# EAGLE design Loco-Single (EAGLE 9.7.0)

## Sheet 1 of 2
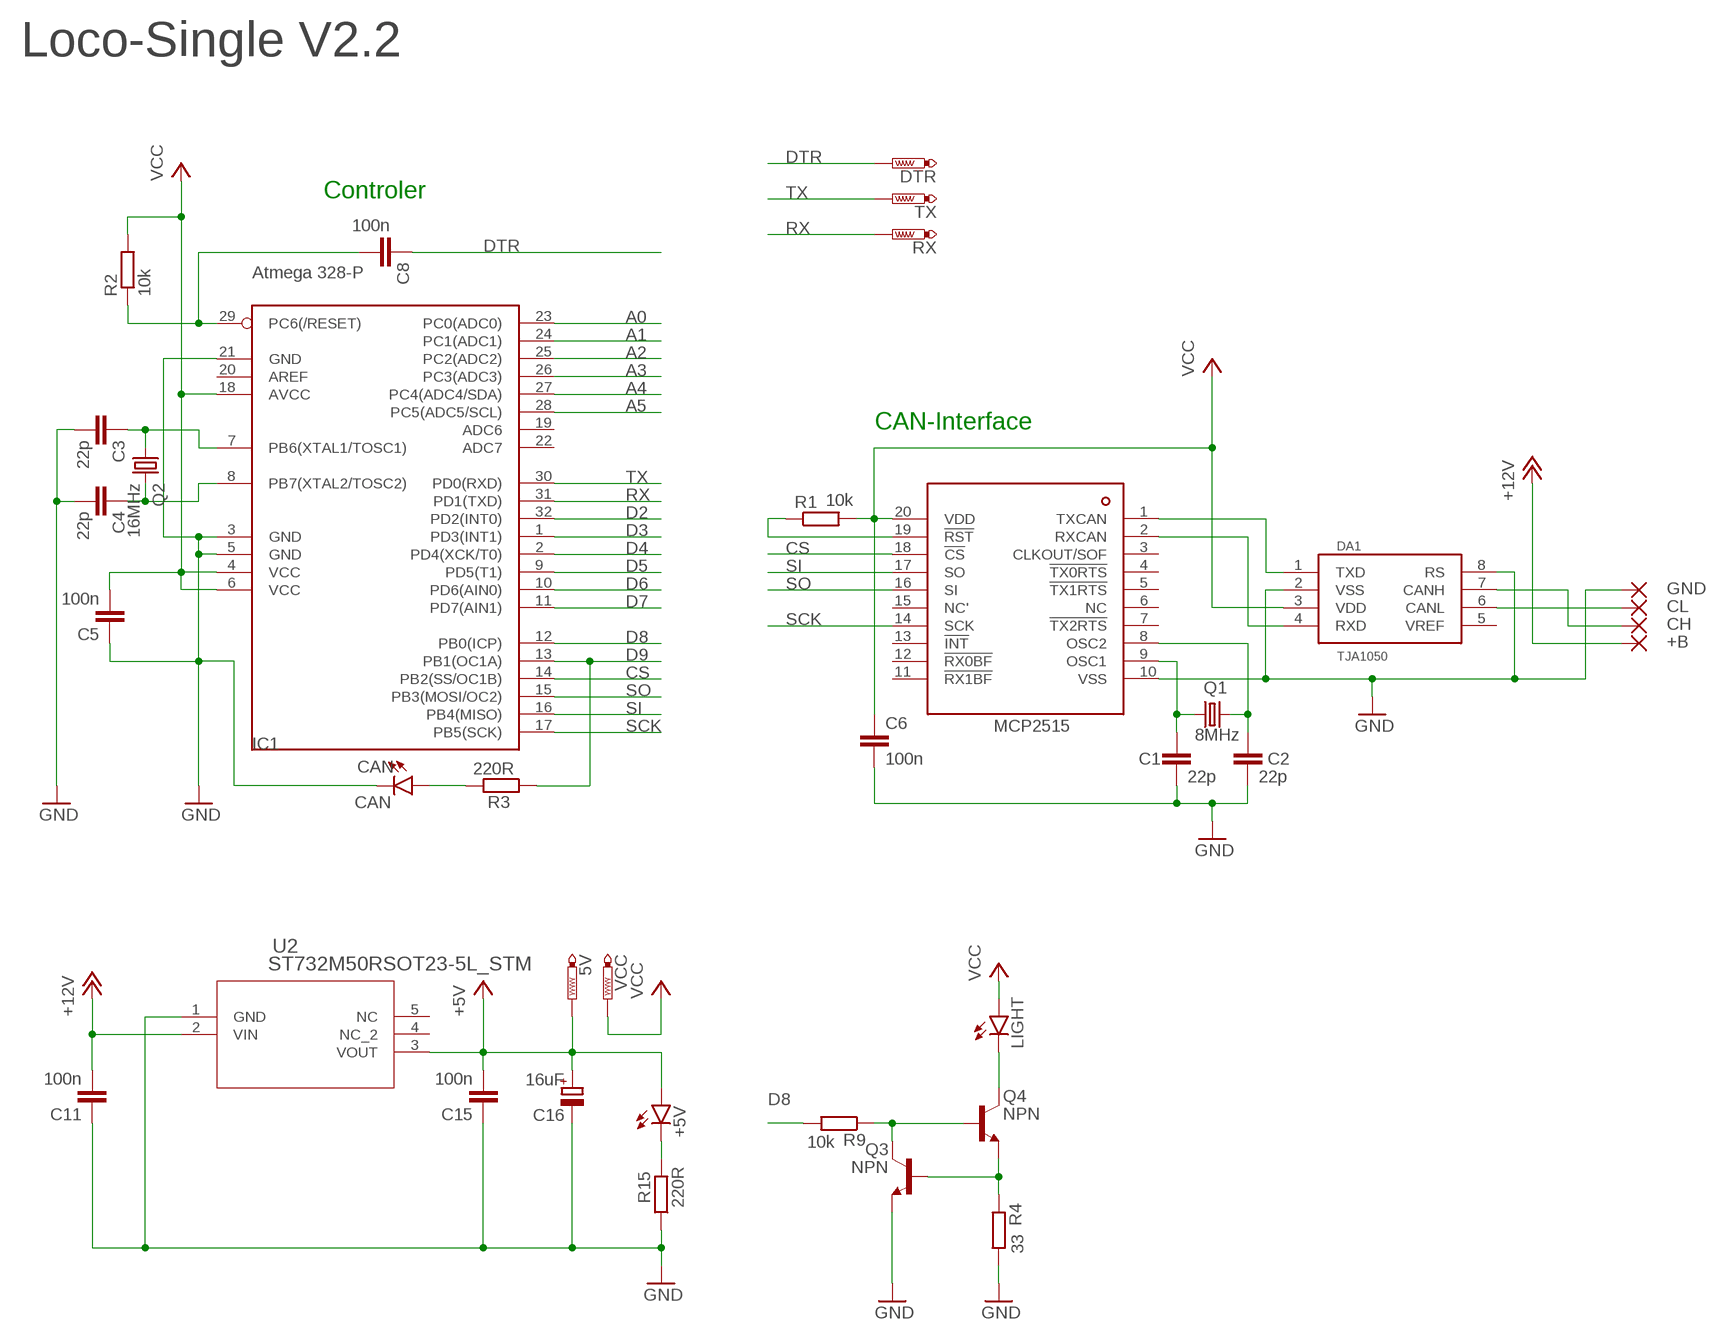
[diagram p0: schematic, sheet 1]

### Parts
5V  PTR1B1,27  [B1,27]
+5V  LEDCHIP-LED0603  [CHIP-LED0603]
+B  1,6/0,8  [1,6/0,8]
C1  22p  C-EUC0402K  [C0402K]
C2  22p  C-EUC0402K  [C0402K]
C3  22p  C-EUC0402K  [C0402K]
C4  22p  C-EUC0402K  [C0402K]
C5  100n  C-EUC0402K  [C0402K]
C6  100n  C-EUC0402K  [C0402K]
C8  100n  C-EUC0402K  [C0402K]
C11  100n  C-EUC0402K  [C0402K]
C15  100n  C-EUC0402K  [C0402K]
C16  16uF  CPOL-EUA/3216-18W  [A/3216-18W]
CAN  CAN  LED_CHIP_BLUE-1608  [LEDC1608X39N_B]
CH  1,6/0,8  [1,6/0,8]
CL  1,6/0,8  [1,6/0,8]
DA1  TJA1050  [SO08]
DTR  PTR1B1,27  [B1,27]
GND  1,6/0,8  [1,6/0,8]
IC1  Atmega 328-P  MEGA8-AI  [TQFP32-08]
IC2  MCP2515  [TSSOP20]
LIGHT  LEDCHIP-LED0603  [CHIP-LED0603]
Q1  8MHz  KX-9B  [5.0X3.2_2]
Q2  16MHz  KX-9B  [5.0X3.2_2]
Q3  NPN  NPN_SOT23-BEC  [SOT95P237X112-3N]
Q4  NPN  NPN_SOT23-BEC  [SOT95P237X112-3N]
R1  10k  R-EU_R0402  [R0402]
R2  10k  R-EU_R0402  [R0402]
R3  220R  R-EU_R0402  [R0402]
R4  33  R-EU_R0402  [R0402]
R9  10k  R-EU_R0402  [R0402]
R15  220R  R-EU_R0402  [R0402]
RX  PTR1B1,27  [B1,27]
TX  PTR1B1,27  [B1,27]
U2  ST732M50RSOT23-5L_STM  [SOT23-5L_STM]
VCC  PTR1B1,27  [B1,27]

### Nets
+5V: 5V.TP +5V.A C15.2 C16.+ U2.3(VOUT)
+12V: +B.1(P) C11.2 U2.2(VIN)
A0: IC1.23(PC0(ADC0))
A1: IC1.24(PC1(ADC1))
A2: IC1.25(PC2(ADC2))
A3: IC1.26(PC3(ADC3))
A4: IC1.27(PC4(ADC4/SDA))
A5: IC1.28(PC5(ADC5/SCL))
CAN-H: CH.1(P) DA1.7(CANH)
CAN-L: CL.1(P) DA1.6(CANL)
CAN-OCC1: C1.1 IC2.9(OSC1) Q1.1
CAN-OCC2: C2.1 IC2.8(OSC2) Q1.2
CS: IC1.14(PB2(SS/OC1B)) IC2.18(!CS)
D2: IC1.32(PD2(INT0))
D3: IC1.1(PD3(INT1))
D4: IC1.2(PD4(XCK/T0))
D5: IC1.9(PD5(T1))
D6: IC1.10(PD6(AIN0))
D7: IC1.11(PD7(AIN1))
D8: IC1.12(PB0(ICP)) R9.2
D9: IC1.13(PB1(OC1A)) R3.1
DTR: C8.1 DTR.TP
GND: C1.2 C2.2 C3.2 C4.2 C5.1 C6.2 C11.1 C15.1 C16.- CAN.1(C) DA1.2(VSS) DA1.8(RS) GND.1(P) IC1.3(GND) IC1.5(GND) IC1.21(GND) IC2.10(VSS) Q3.2(E) R4.2 R15.1 U2.1(GND)
N$3: CAN.2(A) R3.2
N$4: Q3.1(B) Q4.2(E) R4.1
N$5: Q3.3(C) Q4.1(B) R9.1
N$6: IC2.19(!RST) R1.1
N$7: LIGHT.C Q4.3(C)
N$10: C3.1 IC1.7(PB6(XTAL1/TOSC1)) Q2.1
N$11: C4.1 IC1.8(PB7(XTAL2/TOSC2)) Q2.2
N$12: +5V.C R15.2
N$15: C8.2 IC1.29(PC6(/RESET)) R2.1
RX: IC1.31(PD1(TXD)) RX.TP
RXCAN: DA1.4(RXD) IC2.2(RXCAN)
SCK: IC1.17(PB5(SCK)) IC2.14(SCK)
SI: IC1.16(PB4(MISO)) IC2.17(SO)
SO: IC1.15(PB3(MOSI/OC2)) IC2.16(SI)
TX: IC1.30(PD0(RXD)) TX.TP
TXCAN: DA1.1(TXD) IC2.1(TXCAN)
VCC: C5.2 C6.1 DA1.3(VDD) IC1.4(VCC) IC1.6(VCC) IC1.18(AVCC) IC2.20(VDD) LIGHT.A R1.2 R2.2 VCC.TP
Unconnected: DA1.5(VREF) IC1.19(ADC6) IC1.20(AREF) IC1.22(ADC7) IC2.3(CLKOUT/SOF) IC2.4(!TX0RTS) IC2.5(!TX1RTS) IC2.6(NC) IC2.7(!TX2RTS) IC2.11(!RX1BF) IC2.12(!RX0BF) IC2.13(!INT) IC2.15(NC') U2.4(NC_2) U2.5(NC)

### Notes on the sheet
- Loco-Single V2.2
- Controler
- CAN-Interface

## Sheet 2 of 2

## Library data of the parts
5V DTR RX TX VCC = testpad:PTR1: TEST PIN
+5V LIGHT = led:LED: LED OSRAM: - CHIPLED LG R971, LG N971, LY N971, LG Q971, LY Q971, LO R971, LY R971 LH N974, LH R974 LS Q976, LO Q976, LY Q976 LO Q996 - Hyper CHIPLED LW Q18S LB Q993, LB Q99A, LB R99A - SideLED LS A670, LO A670, LY A670, LG A670, LP A670 LB A673, LV A673, LT A673, LW A673 LH A674 LY A675 LS A676, LA A676, LO A676, LY A676, LW A676 LS A679, LY A679, LG A679 - Hyper Micro SIDELED® LS Y876, LA Y876, LO Y876, LY Y876 LT Y87S - SmartLED LW L88C, LW L88S LB L89C, LB L89S, LG L890 LS L89K, LO L89K, LY L89K LS L896, LA L896, LO L896, LY L896 - TOPLED LS T670, LO T670, LY T670, LG T670, LP T670 LSG T670, LSP T670, LSY T670, LOP T670, LYG T670 LG T671, LOG T671, LSG T671 LB T673, LV T673, LT T673, LW T673 LH T674 LS T676, LA T676, LO T676, LY T676, LB T676, LH T676, LSB T676, LW T676 LB T67C, LV T67C, LT T67C, LS T67K, LO T67K, LY T67K, LW E67C LS E67B, LA E67B, LO E67B, LY E67B, LB E67C, LV E67C, LT E67C LW T67C LS T679, LY T679, LG T679 LS T770, LO T770, LY T770, LG T770, LP T770 LB T773, LV T773, LT T773, LW T773 LH T774 LS E675, LA E675, LY E675, LS T675 LS T776, LA T776, LO T776, LY T776, LB T776 LHGB T686 LT T68C, LB T68C - Hyper Mini TOPLED® LB M676 - Mini TOPLED Santana® LG M470 LS M47K, LO M47K, LY M47K Source: http://www.osram.convergy.de LUXEON: - LUMILED® LXK2-PW12-R00, LXK2-PW12-S00, LXK2-PW14-U00, LXK2-PW14-V00 LXK2-PM12-R00, LXK2-PM12-S00, LXK2-PM14-U00 LXK2-PE12-Q00, LXK2-PE12-R00, LXK2-PE12-S00, LXK2-PE14-T00, LXK2-PE14-U00 LXK2-PB12-K00, LXK2-PB12-L00, LXK2-PB12-M00, LXK2-PB14-N00, LXK2-PB14-P00, LXK2-PB14-Q00 LXK2-PR12-L00, LXK2-PR12-M00, LXK2-PR14-Q00, LXK2-PR14-R00 LXK2-PD12-Q00, LXK2-PD12-R00, LXK2-PD12-S00 LXK2-PH12-R00, LXK2-PH12-S00 LXK2-PL12-P00, LXK2-PL12-Q00, LXK2-PL12-R00 Source: www.luxeon.com KINGBRIGHT: KA-3528ASYC Source: www.kingbright.com
+B CH CL GND = wirepad:1,6/0,8: THROUGH-HOLE PAD
C1-C6 C8 C11 C15 = rcl:C-EU: CAPACITOR, European symbol; SPICEPREFIX: C
C16 = rcl:CPOL-EU: POLARIZED CAPACITOR, European symbol; SPICEPREFIX: C
CAN = Opto-Electronic:LED_CHIP: LED - Generic; CATEGORY: Opto-Electronic; COLOR: Blue; SUB-CATEGORY: LED; VALUE: LED_BLUE
DA1 = TJA1050:TJA1050: High speed CAN transceiver Input levels compatible with 3.3 V and 5 V devices 5V supply
IC1 = atmel:MEGA8: MICROCONTROLLER 8 Kbytes FLASH, 1 kbytes SRAM, 512 bytes EEPROM, USART, 6-channel 10 bit ADC, 2-channel 8 bit ADC Pin compatible with Atmega48, ATMega88, ATMega168 Source: avr.lbr; MPN: ATMEGA8-16AU; OC_FARNELL: 9171371; OC_NEWARK: 73M8863
IC2 = mcp2514:MCP2515: Microchip Technology’s MCP2515 is a stand-alone Controller Area Network (CAN) controller that implements the CAN specification, version 2.0B. It is capable of transmitting and receiving both standard and extended data and remote frames. The MCP2515 has two acceptance masks and six acceptance filters that are used to filter out unwanted messages, thereby reducing the host MCUs overhead. The MCP2515 interfaces with microcontrollers (MCUs) via an industry standard Serial Peripheral Interface (SPI).
Q1 Q2 = crystal-geyer_V1_0:KX: Quartz Crystals (MHz) SMD: KX - Serie Model Size l/w/h [mm] Frequency Range Frequency Stability Temp. Range [°C] Load Capacitance AECQ 200 availabel Datasheet KX-4 KX-5 KX-6 KX-7 KX-9A KX-9B KX-12A KX-12B KX-13 KX-20 KX-K KX-KS 1.6/1.2/0.3 2.0/1.6/0.45 2.5/2.0/0.55 3.2/2.5/0.8 5.0/3.2/1.0 5.0/3.2/1.1 6.0/3.5/1.1 6.0/3.5/1.0 7.0/5.0 /1.3 11.6/5.5/1.6 12.3/4.5/4.2 12.3/4.5/3.2 24.0 ~ 80.0 MHz 16.0 ~ 80.0 MHz 12.0 ~ 80.0 MHz 8.0 ~ 60.0 MHz 7,68 ~ 300,0 MHz 8,0 ~ 50,0 MHz 8,0 ~ 150,0 MHz 8,0 ~ 50,0 MHz 6,0 ~ 160,0 MHz 3,579 ~ 25,0 MHz 3,579 ~ 70,0 MHz 3,579 ~ 70,0 MHz ±10 … ±50ppm ±10 … ±50ppm ±10 … ±50ppm ±10 … ±50ppm ±10 … ±50ppm ±10 … ±50ppm ±10 … ±50ppm ±10 … ±50ppm ±10 … ±50ppm ±50ppm ±10 … ±50ppm ±10 … ±50ppm (*) -40°C …+85°C (*) -40°C …+125°C (*) -40°C …+125°C (*) -40°C …+125°C (*) -40°C …+105°C (*) -40°C …+105°C (*) -40°C …+125°C (*) -40°C …+105°C (*) -40°C …+105°C (*) -40°C …+105°C (*) -40°C …+85°C (*) -40°C …+85°C 8, 8…16 8, 8…16 10, 8…16 12, 7…20 16, 10…20 16, 10…20 16, 10…20 16, 12…20 16, 12…20 16, 12…20 16, 12…30 16, 12…30 - yes yes yes - - - - - - - - KX-4.pdf <http://www.geyer-electronic.de/uploads/tx_userartikelfrequenz/GEYER-KX-4.pdf> KX-5.pdf <http://www.geyer-electronic.de/uploads/tx_userartikelfrequenz/GEYER-KX-5.pdf> KX-6.pdf <http://www.geyer-electronic.de/uploads/tx_userartikelfrequenz/GEYER-KX-6.pdf> KX-7.pdf <http://www.geyer-electronic.de/uploads/tx_userartikelfrequenz/GEYER-KX-7.pdf> KX-9A.pdf <http://www.geyer-electronic.de/uploads/tx_userartikelfrequenz/GEYER-KX-9A.pdf> KX-9B.pdf <http://www.geyer-electronic.de/uploads/tx_userartikelfrequenz/GEYER-KX-9B.pdf> KX-12A.pdf <http://www.geyer-electronic.de/uploads/tx_userartikelfrequenz/GEYER-KX-12A.pdf> KX-12B.pdf <http://www.geyer-electronic.de/uploads/tx_userartikelfrequenz/GEYER-KX-12B.pdf> KX-13.pdf <http://www.geyer-electronic.de/uploads/tx_userartikelfrequenz/GEYER-KX-13.pdf> KX-20.pdf <http://www.geyer-electronic.de/uploads/tx_userartikelfrequenz/GEYER-KX-20.pdf> KX-K.pdf <http://www.geyer-electronic.de/uploads/tx_userartikelfrequenz/GEYER-KX-K.pdf> KX-KS.pdf <http://www.geyer-electronic.de/uploads/tx_userartikelfrequenz/GEYER-KX-KS.pdf> <http://www.geyer-electronic.de/fileadmin/template/img/logo-geyer-electronic.png> Details see: http://www.geyer-electronic.de/Frequenz-Produkte.9.0.html Created 2016-06-07, Hans Locher 2016 (C) Geyer Quartz Technology KX4,KX5,KX6,KX7,KX9A,KX9B,KX12A,KX12B,KX13,KX20,KXK,KXKS;1612;2016;2520;3225;5032;6035;7050;11655;12345;1,6x1,2;2,0x1,6;2,5x2,0;3,2x2,5;5,0x3,2;6,0x3,5;7,0x5,0;11,6x5,5;12,3x4,5;12,3x4,5;1.6x1.2;2.0x1.6;2.5x2.0;3.2x2.5;5.0x3.2;6.0x3.5;7.0x5.0;11.6x5.5;12.3x4.5;12.3x4.5;
Q3 Q4 = Transistor:NPN: NPN - Generic; CATEGORY: Transistor; SUB-CATEGORY: BJT; TYPE: NPN
R1-R4 R9 R15 = rcl:R-EU_: RESISTOR, European symbol; SPICEPREFIX: R
U2 = ST732:ST732M50R; COPYRIGHT: Copyright (C) 2023 Ultra Librarian. All rights reserved.; MANUFACTURER_PART_NUMBER: ST732M50R; MFR_NAME: STMicroelectronics

## Board
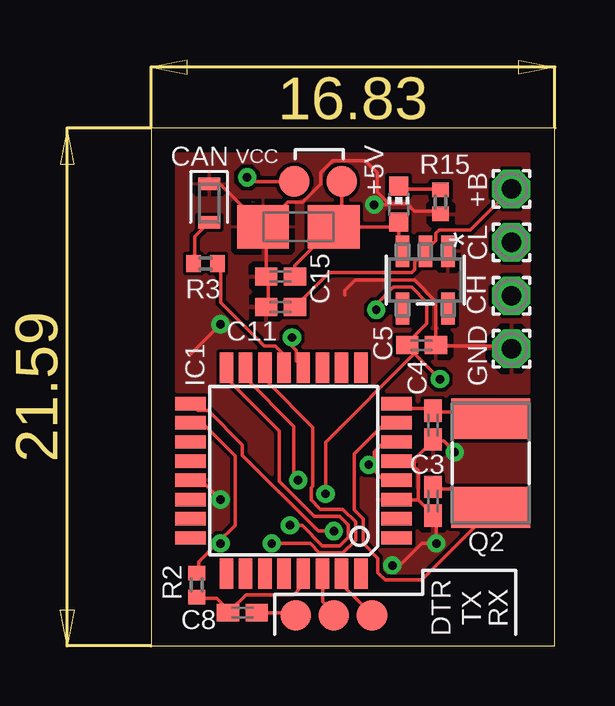
[diagram p1: board, top side]
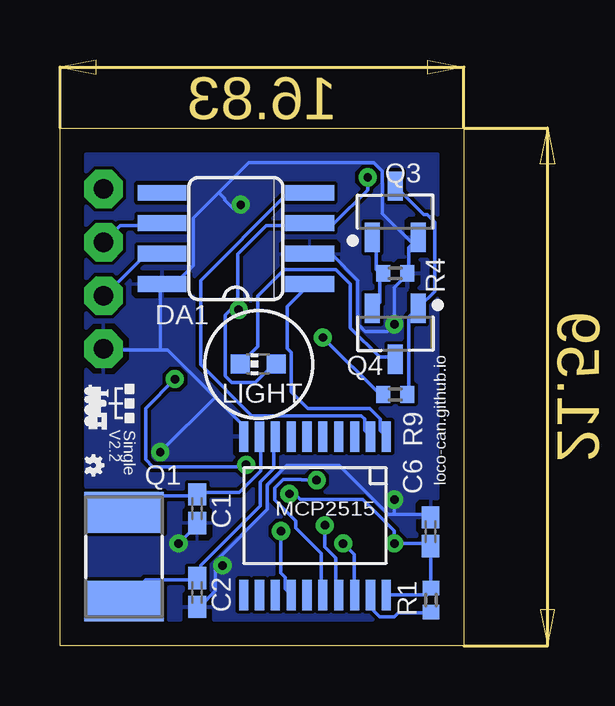
[diagram p2: board, bottom side, seen from below]

Size 16.83 x 21.59 mm. Coordinates in mm from the lower left corner, seen from the top.
Outline: 16.83,21.59 0,21.59 0,0 16.83,0 16.83,21.59
Copper layers (1*16): Top / Bottom
Stack-up Default Layer Stack: Top User Defined 0.035mm / Dielectric-1 User Defined 1.5mm / Bottom User Defined 0.035mm
Design rules "default": minimum track width 6mil, minimum drill 0.35mm, track to track 6mil, track to pad 6mil, pad to pad 6mil, via to via 6mil, smd to smd 6mil, copper to edge 40mil, drill to drill 6mil, minimum pad ring 10mil, minimum via ring 8mil, stop-mask expansion 4mil, vias tented up to drill 0mil, thermal gap 10mil

### Footprints (pad centres in the part's own frame; a part is rotated, then mirrored left to right if it is on the bottom)
B1,27 = smd 1.27 x 1.27: TP 0,0
CHIP-LED0603 = smd 0.8 x 0.8: A 0,-0.75; C 0,0.75
1,6/0,8 = drill 0.813 pad 1.6 octagon: 1 0,0
C0402K = smd 0.925 x 0.74: 1 -0.6,0; 2 0.6,0
A/3216-18W = smd 2.15 x 1.8: + 1.475,0; - -1.475,0
LEDC1608X39N_B = smd 0.512 x 0.912: 1 -0.8,0; 2 0.8,0
SO08 = smd 0.66 x 2.032: 1 -1.905,-3.073; 2 -0.635,-3.073; 3 0.635,-3.073; 4 1.905,-3.073; 5 1.905,3.073; 6 0.635,3.073; 7 -0.635,3.073; 8 -1.905,3.073
TQFP32-08 = smd 1.27 x 0.559: 1 -4.293,2.8; 2 -4.293,2; 3 -4.293,1.2; 4 -4.293,0.4; 5 -4.293,-0.4; 6 -4.293,-1.2; 7 -4.293,-2; 8 -4.293,-2.8; 17 4.293,-2.8; 18 4.293,-2; 19 4.293,-1.2; 20 4.293,-0.4; 21 4.293,0.4; 22 4.293,1.2; 23 4.293,2; 24 4.293,2.8 | smd 0.559 x 1.27: 9 -2.8,-4.293; 10 -2,-4.293; 11 -1.2,-4.293; 12 -0.4,-4.293; 13 0.4,-4.293; 14 1.2,-4.293; 15 2,-4.293; 16 2.8,-4.293; 25 2.8,4.293; 26 2,4.293; 27 1.2,4.293; 28 0.4,4.293; 29 -0.4,4.293; 30 -1.2,4.293; 31 -2,4.293; 32 -2.8,4.293
TSSOP20 = smd 1.27 x 0.381: 1 -3.302,2.642; 2 -3.302,1.981; 3 -3.302,1.321; 4 -3.302,0.66; 5 -3.302,0; 6 -3.302,-0.66; 7 -3.302,-1.321; 8 -3.302,-1.981; 9 -3.302,-2.642; 10 -3.302,-3.302; 11 3.302,-3.302; 12 3.302,-2.642; 13 3.302,-1.981; 14 3.302,-1.321; 15 3.302,-0.66; 16 3.302,0; 17 3.302,0.66; 18 3.302,1.321; 19 3.302,1.981; 20 3.302,2.642
5.0X3.2_2 = smd 1.7 x 3.3: 1 -1.85,0; 2 1.85,0
SOT95P237X112-3N = smd 1.224 x 0.625: 1 -1.064,0.95; 2 -1.064,-0.95; 3 1.064,0
R0402 = smd 0.6 x 0.7: 1 -0.5,0; 2 0.5,0
SOT23-5L_STM = smd 1.321 x 0.559: 1 -1.194,0.95; 2 -1.194,0; 3 -1.194,-0.95; 4 1.194,-0.95; 5 1.194,0.95

### Placement (x,y rotation side)
5V  7.94,19.37 0 top
+5V  10.32,18.41 0 top
+B  15.01,19.05 90 top
C1  11.11,5.71 270 bottom
C2  11.11,2.22 270 bottom
C3  11.75,6.03 270 top
C4  11.75,9.21 270 top
C5  11.27,12.54 180 top
C6  1.39,4.76 90 bottom
C8  3.81,1.39 180 top
C11  5.4,14.13 0 top
C15  5.4,15.4 0 top
C16  6.14,17.47 0 top
CAN  2.42,18.46 270 top
CH  15.01,14.61 90 top
CL  15.01,16.83 90 top
DA1  9.5,16.99 90 bottom
DTR  6.03,1.27 180 top
GND  15.01,12.38 90 top
IC1  5.94,7.3 180 top
IC2  5.87,5.43 270 bottom
LIGHT  8.57,11.75 90 bottom
Q1  14.16,3.72 270 bottom
Q2  14.16,7.62 90 top
Q3  2.86,18.1 90 bottom
Q4  2.86,13.02 270 bottom
R1  1.37,1.91 90 bottom
R2  1.91,2.54 90 top
R3  2.27,15.94 180 top
R4  2.86,15.54 0 bottom
R9  2.86,10.48 180 bottom
R15  12.06,18.51 90 top
RX  9.21,1.27 180 top
TX  7.62,1.27 180 top
U2  11.43,15.26 270 top
VCC  5.97,19.37 0 top

### Tracks (layer width: path | path; a pad name or v marks a point on that pad's centre or on a via)
+5V
  Top 0.152: 5V.TP 7.94,17.79 C16.+ | C15.2 6,15.85 C16.+ | C16.+ 10.12,17.47 +5V.A 10.32,16.61 U2.3
+12V
  Top 0.152: +B.1 13.3,17.34 12.01,17.34 11.87,17.21 11.87,16.89 11.46,16.48 U2.2 10.99,16.01 10.99,15.7 10.85,15.56 7.43,15.56 C11.2
CAN-H
  Bottom 0.152: DA1.7 12.65,16.31 13.26,16.31 14.94,14.63 CH.1
CAN-L
  Bottom 0.152: DA1.6 12.65,17.53 14.33,17.53 14.94,16.92 CL.1
CAN-OCC1
  Bottom 0.152: Q1.1 14.02,5.64 13.41,6.25 11.12,6.25 C1.1 10.97,6.4 9.36,6.4 8.46,7.3 8.46,8.68 IC2.9
CAN-OCC2
  Bottom 0.152: Q1.2 14.02,1.98 13.26,2.74 11.12,2.74 C2.1 10.97,2.9 10.97,3.35 8.49,5.84 8.49,6.84 7.92,7.4 7.92,8.66 IC2.8
CS  (via drill 0.35)
  Top 0.152: IC1.14 4.88,11.58 4.88,10.97 6.74,9.11 6.74,6.66 6.67,6.59 6.67,6.08 7.05,5.7 8,5.7 8.53,5.16 8.53,4.41 8,3.87 7.02,3.87 6.62,4.27 v5.03,4.27
  Bottom 0.152: v5.03,4.27 4.57,3.81 4.57,2.13 IC2.18
D8  (via drill 0.35)
  Top 0.152: IC1.12 6.05,11.89 6.05,12.32 5.87,12.5 v5.87,12.86
  Bottom 0.152: v5.87,12.86 3.49,10.48 R9.2
D9
  Top 0.152: R3.1 2.9,15.85 2.9,14.33 4.72,12.5 5.18,12.5 5.49,12.19 5.49,11.73 IC1.13
DTR
  Top 0.152: C8.1 4.42,1.37 5.94,1.37 DTR.TP
GND  (via drill 0.35)
  Top 0.152: 10.97,7.77 11.73,8.53 C4.2 11.89,8.53 12.19,8.53 v12.65,8.08 | 10.97,7.77 10.36,7.77 IC1.5 | 11.12,6.1 10.36,6.1 IC1.3 | 11.12,6.1 11.73,5.49 C3.2 11.89,5.33 v11.89,4.27 11.28,4.27 10.36,3.35 v10.06,3.35 | 10.97,7.77 10.97,7.47 11.12,7.32 11.12,6.1 | v2.9,6.1 2.13,6.86 1.68,6.86 IC1.21 | C11.1 4.88,14.17 4.88,15.37 C15.1 4.8,16.67 4.45,17.55 4.49,17.59 C16.- | 9.91,18.44 10.67,18.44 10.97,18.14 12.04,18.14 R15.1 | 1.68,12.19 v2.9,13.41 | GND.1 14.94,12.5 11.89,12.5 C5.1 11.87,14.37 10.98,15.26 8.51,15.26 8.07,14.82 8.07,14.62 | 9.91,18.44 9.44,18.91 9.44,19.73 8.93,20.23 7.58,20.23 7.07,19.73 7.07,19.25 6.33,18.5 5.7,18.5 C16.- | 9.91,18.44 9.86,18.39 v9.3,18.39 | CAN.1 2.48,19.2 2.93,19.2 C16.-
  Bottom 0.152: v11.89,4.27 11.12,5.03 C1.2 | 2.9,5.49 1.52,5.49 C6.2 | 10.36,3.35 10.36,2.29 10.97,1.68 C2.2 | 10.36,3.35 10.36,3.5 8.18,5.68 8.18,6.71 7.38,7.52 5.19,7.52 3.16,5.49 2.9,5.49 | 2.9,5.49 v2.9,6.1 | 10.36,3.35 v10.06,3.35 | 2.13,16.76 1.98,16.92 Q3.2 2.13,16.76 | 2.13,16.76 2.29,16.61 2.29,15.54 R4.2 2.44,15.39 2.9,14.94 v2.9,13.41 3.2,13.11 4.12,13.11 4.42,13.41 4.42,15.24 5.49,16.31 6.4,16.31 DA1.2 | 10.36,10.36 12.34,12.34 12.65,12.34 | 10.36,10.36 9.3,9.3 9.3,8.84 IC2.10 | 12.65,12.34 14.94,12.34 GND.1 | 12.65,12.34 12.65,14.94 DA1.8 12.5,15.09 12.04,15.09 11.28,15.85 11.28,17.83 10.21,18.9 | 10.36,10.36 v12.65,8.08 | 10.21,18.9 9.97,18.66 9.97,18.58 9.62,18.22 9.47,18.22 v9.3,18.39 | 2.13,16.76 3.4,18.03 3.4,19.79 3.75,20.14 8.97,20.14 10.21,18.9
  pour Bottom: 0,21.59 16.83,21.59 16.83,0 0,0
  pour Top: 0,21.59 16.83,21.59 16.83,0 0,0
N$3
  Top 0.152: R3.2 1.83,16 1.83,17.07 2.29,17.53 CAN.2
N$4
  Bottom 0.152: Q4.2 3.66,14.17 3.5,14.33 3.5,15.39 R4.1 3.5,15.54 3.66,15.7 3.66,16.92 Q3.1
N$5
  Bottom 0.152: R9.1 2.29,10.52 2.29,13.72 1.98,14.02 Q4.1 1.83,14.17 1.22,14.78 1.22,17.68 1.52,17.98 1.68,17.98 2.74,19.05 Q3.3
N$6
  Bottom 0.152: R1.1 1.37,1.37 2.74,1.37 2.9,1.22 3.5,1.22 3.81,1.52 3.81,1.98 IC2.19
N$7
  Bottom 0.152: Q4.3 2.9,12.04 3.5,12.04 4.72,13.26 4.72,15.09 5.33,15.7 7.48,15.7 8.59,14.59 8.59,12.48 LIGHT.C
N$10
  Top 0.152: C3.1 11.89,6.55 13.26,6.55 14.02,5.79 Q2.1 14.17,5.64 11.28,2.74 9.75,2.74 9.45,3.05 9.45,3.66 8.84,4.27 8.84,5.29 8.46,5.66 8.46,8.01 9.75,9.3 10.21,9.3 IC1.7
N$11
  Top 0.152: IC1.8 10.36,10.06 10.52,9.91 11.73,9.91 C4.1 11.89,9.75 13.87,9.75 14.02,9.6 Q2.2
N$12
  Top 0.152: R15.2 12.04,19.05 10.36,19.05 +5V.C
N$15
  Top 0.152: R2.1 1.98,1.98 2.74,1.98 3.2,1.52 C8.2 3.35,1.52 3.96,2.13 5.94,2.13 6.25,2.44 6.25,2.9 IC1.29
RX
  Top 0.152: IC1.31 8.08,2.9 8.08,2.44 9.14,1.37 RX.TP
RXCAN
  Bottom 0.152: DA1.4 6.55,18.75 7.47,18.75 10.97,15.24 10.97,11.73 8.83,9.6 4.27,9.6 4.13,9.46 4.13,8.97 IC2.2
SCK  (via drill 0.35)
  Top 0.152: IC1.17 1.94,9.81 2.38,9.81 3.81,8.38 3.81,7.94 6.97,4.79 v7.62,4.79
  Bottom 0.152: IC2.14 7.44,2.37 7.44,2.86 7.62,3.04 v7.62,4.79
SI  (via drill 0.35)
  Top 0.152: IC1.16 3.2,11.58 3.2,11.1 5.34,8.96 5.34,6.85 6.79,5.39 7.87,5.39 8.23,5.04 8.23,4.53 7.87,4.18 7.14,4.18 6.29,5.03 v5.79,5.03
  Bottom 0.152: IC2.17 5.33,2.13 5.33,3.68 5.79,4.13 v5.79,5.03
SO  (via drill 0.35)
  Top 0.152: IC1.15 3.96,11.58 3.96,11.14 5.94,9.16 5.94,7.1 v6.13,6.91
  Bottom 0.152: IC2.16 5.94,2.13 5.94,3.85 7.01,4.92 7.01,5.22 7.88,6.08 7.88,6.59 7.52,6.94 6.79,6.94 6.76,6.91 v6.13,6.91
TX
  Top 0.152: IC1.30 7.16,2.9 7.16,1.83 7.62,1.37 TX.TP
TXCAN
  Bottom 0.152: IC2.1 3.47,8.97 3.47,9.46 3.91,9.9 6.51,9.9 7.19,10.59 7.19,12.24 7.35,12.4 7.35,14.15 DA1.1
VCC  (via drill 0.35)
  Top 0.152: 2.74,4.27 3.5,5.03 3.5,7.92 2.13,9.3 1.68,9.3 IC1.18 | 2.74,4.27 1.98,3.5 1.98,3.05 R2.2 | 2.74,4.27 v2.9,4.27 | 9.3,7.47 9.3,8.08 9.6,8.38 10.21,8.38 IC1.6 | 9.3,7.47 9.3,7.32 9.6,7.01 10.21,7.01 IC1.4 | 10.97,12.19 10.67,12.5 C5.2 | 10.97,12.19 v12.04,11.12 | 10.97,12.19 C5.2 | v9.07,7.55 9.15,7.47 9.3,7.47 | 10.97,12.19 7.27,8.49 v7.27,6.33 | C5.2 10.67,12.62 11.49,13.44 11.49,14.31 10.85,14.95 10.1,14.95 9.38,14.24 v9.38,14.02 | VCC.TP 4.17,19.37 v4,19.53
  Bottom 0.152: 9.42,14.4 9.42,16.33 8.23,17.53 6.55,17.53 DA1.3 5.39,17.62 4,19.01 v4,19.53 | LIGHT.A 7.92,11.73 8.69,10.97 9.67,10.97 9.95,11.25 9.95,13.8 9.42,14.32 9.42,14.4 | IC2.20 3.2,2.13 1.52,2.13 1.37,2.29 R1.2 1.37,2.44 1.37,4.12 C6.1 1.52,4.27 v2.9,4.27 2.9,4.79 4.22,6.12 6.82,6.12 7.04,6.33 v7.27,6.33 | v12.04,11.12 13.26,9.91 13.26,7.77 12.96,7.47 9.15,7.47 v9.07,7.55 | 9.42,14.4 9.38,14.36 v9.38,14.02

### Text on the board
bNames: loco-can.github.io | Single | V2.2